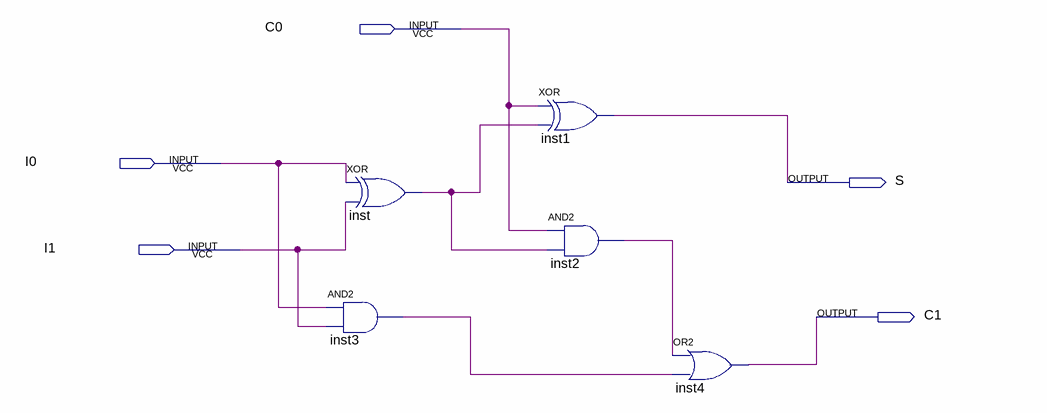
[diagram p0: schematic sheet]
// Quartus schematic adder.bdf as structural Verilog: 5 symbols, 5 pins
module adder (
  input  C0,
  input  I0,
  input  I1,
  output S,
  output C1
);

  wire inst2_out, inst3_out, inst_out;

  xor inst (inst_out, I0, I1);
  and inst3 (inst3_out, I0, I1);
  xor inst1 (S, C0, inst_out);
  and inst2 (inst2_out, C0, inst_out);
  or inst4 (C1, inst2_out, inst3_out);
endmodule
